# EAGLE board 2x16MUX_1 (EAGLE 6.5.0)
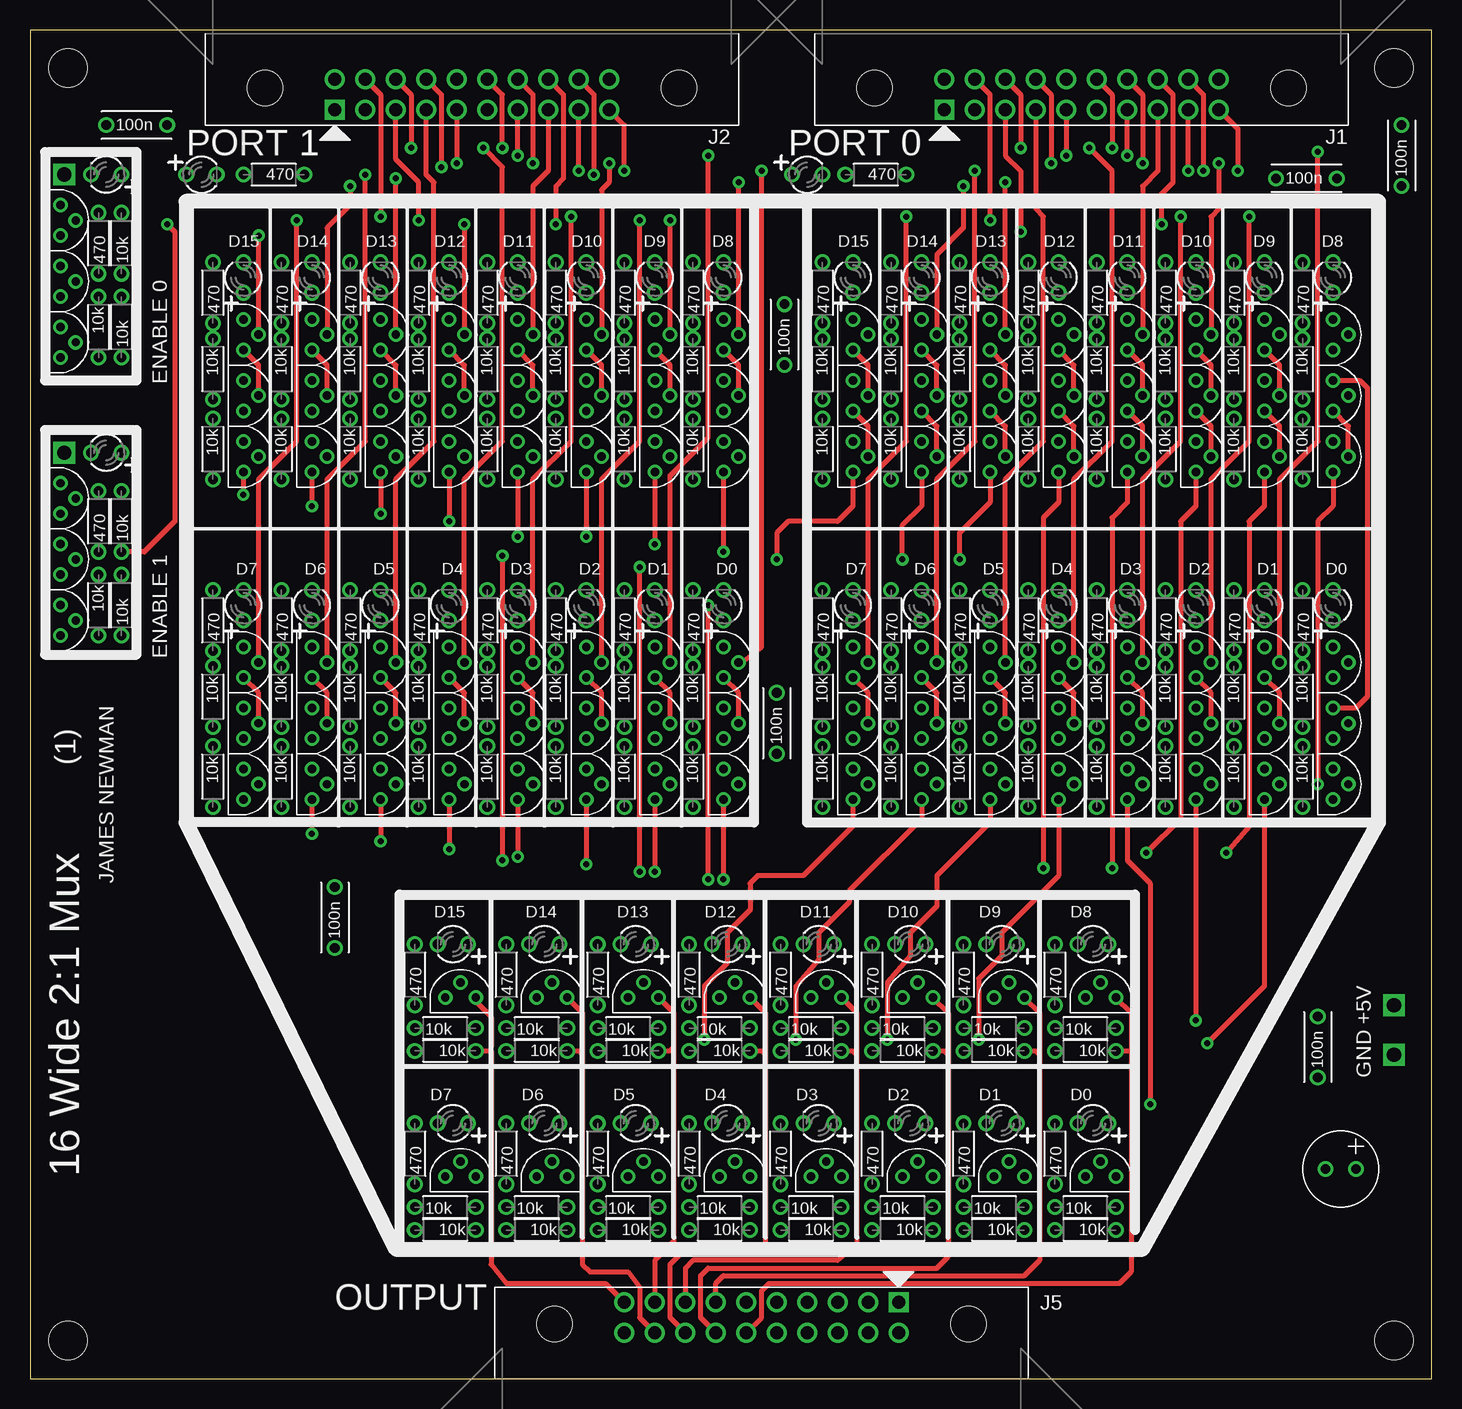
[diagram p10: board, top side]
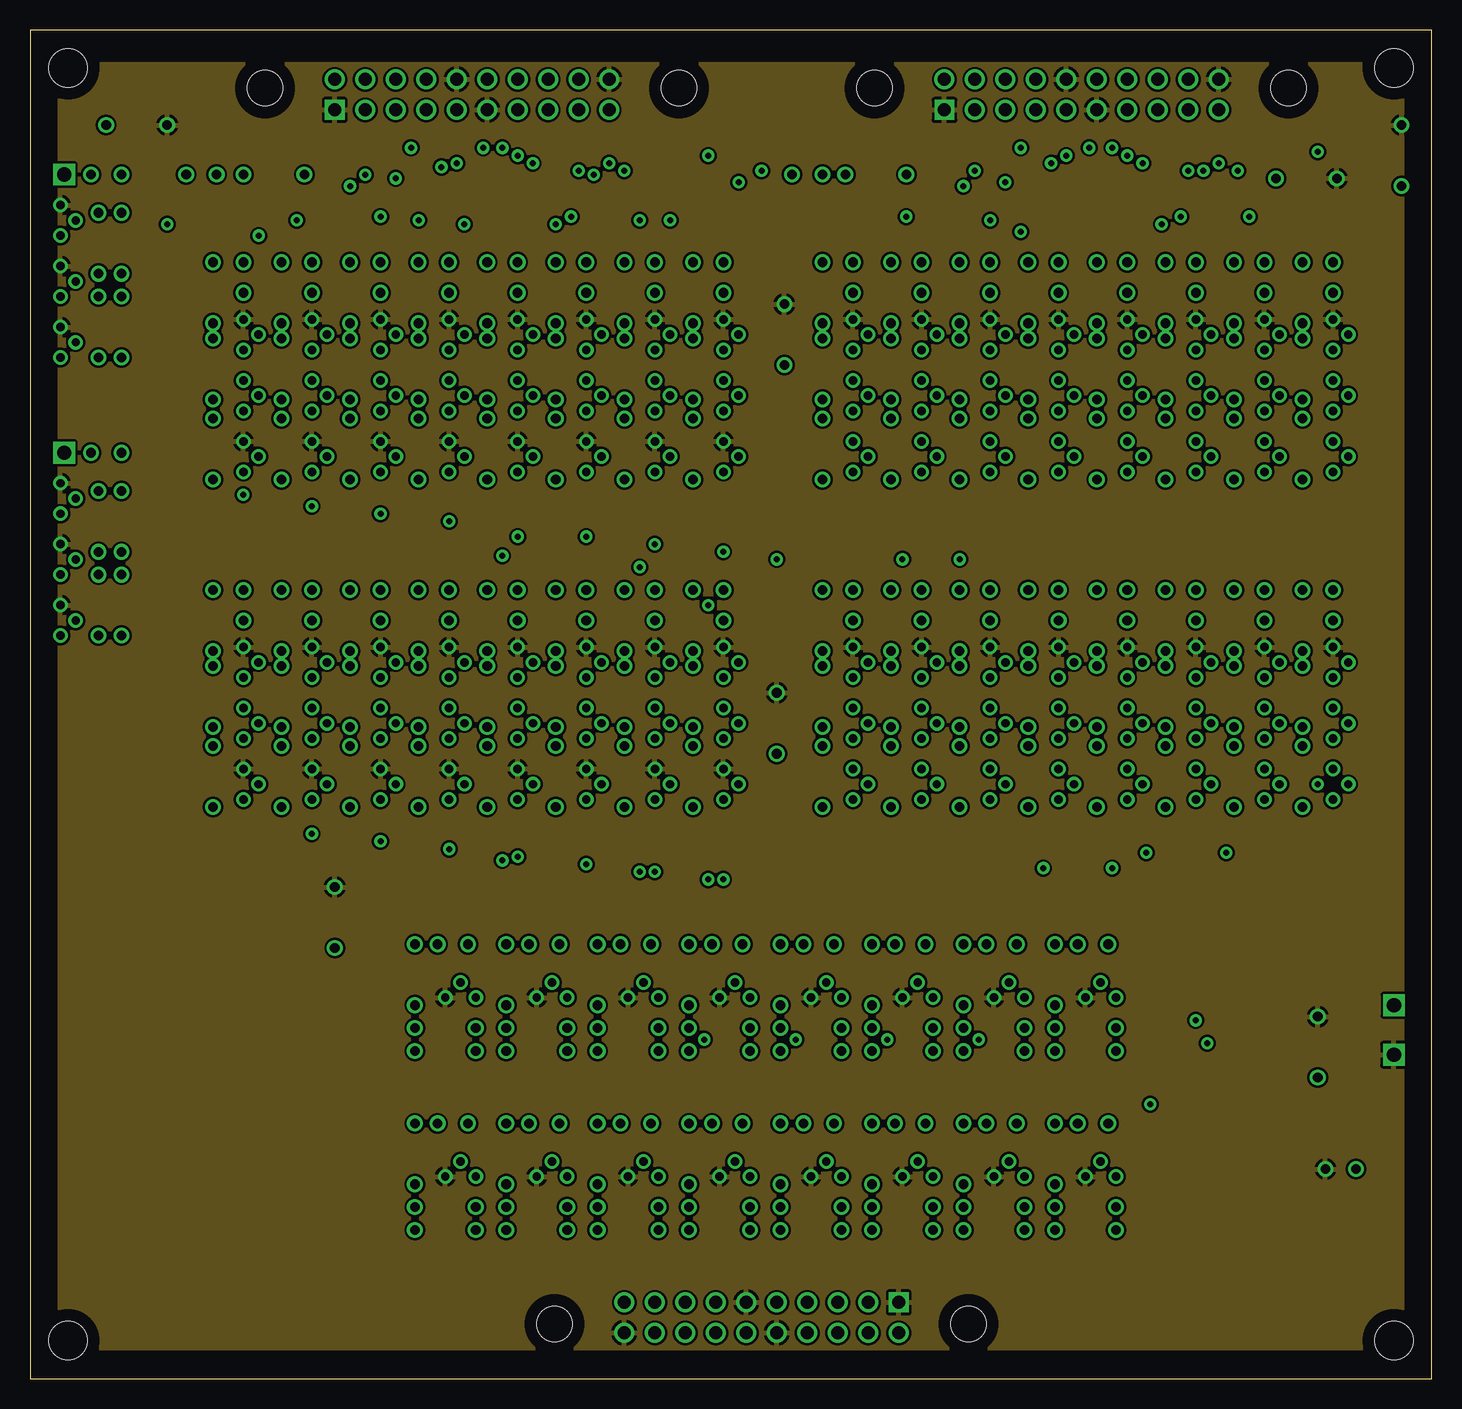
[diagram p11: board, inner layer Route2]
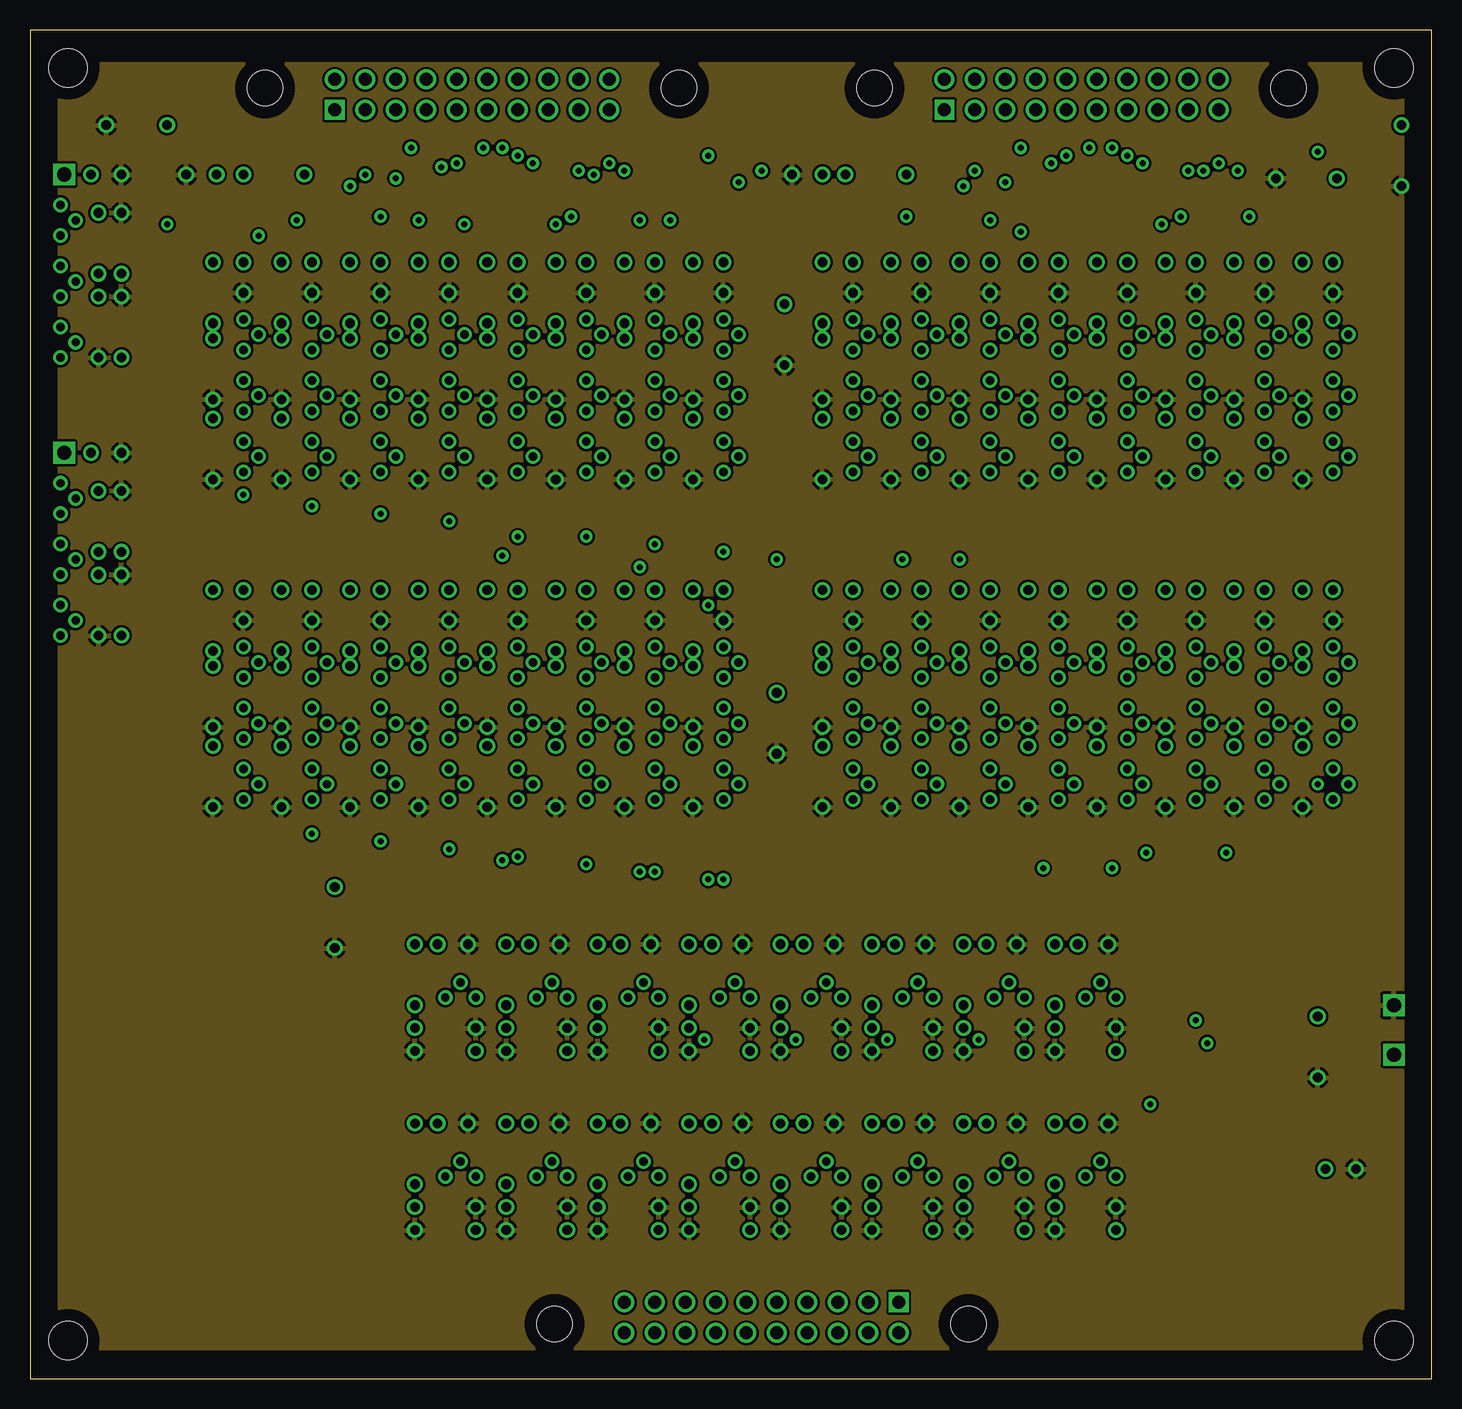
[diagram p12: board, inner layer Route3]
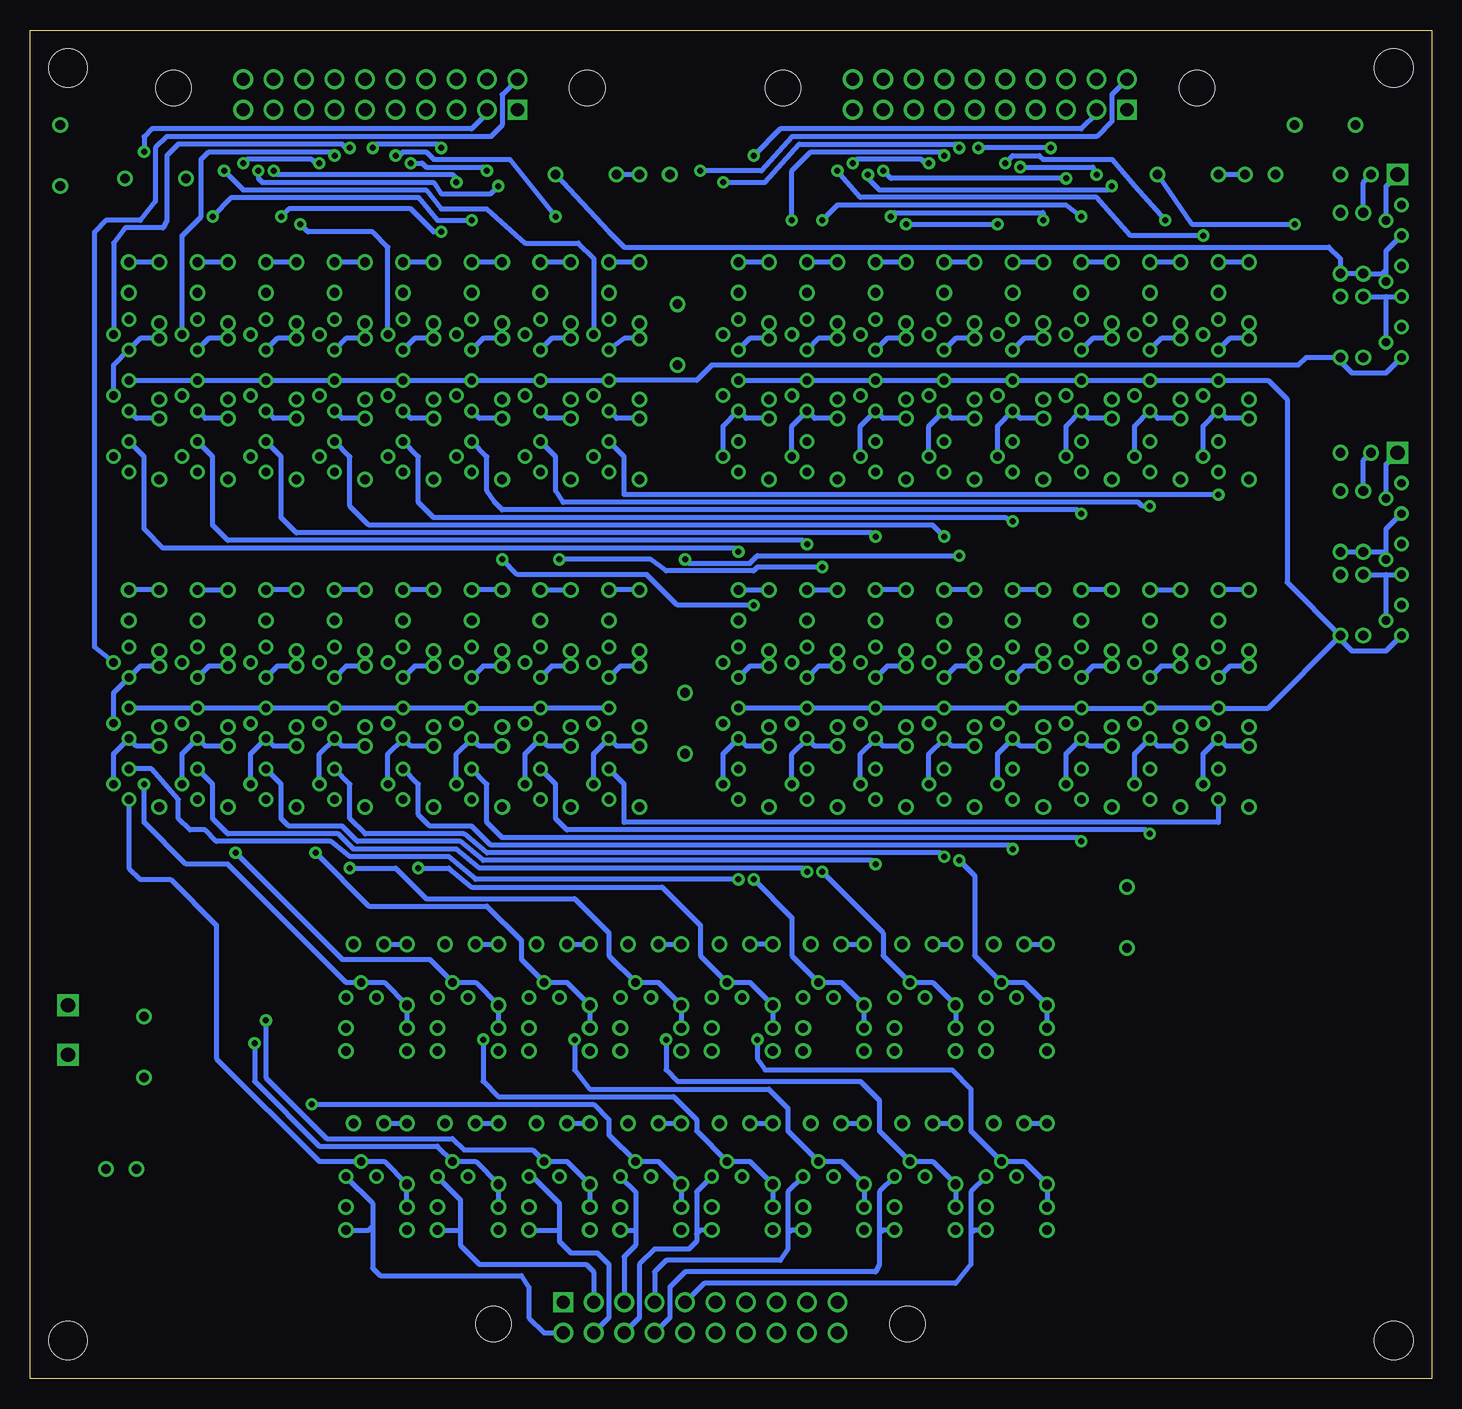
[diagram p13: board, bottom side, seen from below]

Size 116.82 x 112.38 mm. Coordinates in mm from the lower left corner, seen from the top.
Outline: 0,0 116.82,0 116.82,112.38 0,112.38 0,0
Copper layers (1*2+3*16): Top 0.035mm / dielectric 0.2mm / Route2 0.035mm / dielectric 1mm / Route3 0.035mm / dielectric 0.2mm / Bottom 0.035mm
Design rules "processor_rules_4layer": minimum track width 10mil, minimum drill 0.0236mm, track to track 8mil, track to pad 8mil, pad to pad 8mil, via to via 8mil, smd to smd 8mil, copper to edge 40mil, drill to drill 8mil, minimum pad ring 10mil, minimum via ring 8mil, stop-mask expansion 4mil, vias tented up to drill 0.7mm, thermal gap 10mil

## Footprints (pad centres in the part's own frame; a part is rotated, then mirrored left to right if it is on the bottom)
CAP_P2INCH = drill 0.8: 1 -2.54,0; 2 2.54,0
POLARISED_CAP_2P5_6P3MM = drill 0.8: A 1.27,0; K -1.27,0
LED3MM = drill 0.8: A -1.27,0; K 1.27,0
3M_HOLE = hole 3.2: 0,0
20_HDR_LOCKING_RA = drill 1.1 square: 1 -11.43,-1.27 | drill 1.1: 2 -11.43,1.27; 3 -8.89,-1.27; 4 -8.89,1.27; 5 -6.35,-1.27; 6 -6.35,1.27; 7 -3.81,-1.27; 8 -3.81,1.27; 9 -1.27,-1.27; 10 -1.27,1.27; 11 1.27,-1.27; 12 1.27,1.27; 13 3.81,-1.27; 14 3.81,1.27; 15 6.35,-1.27; 16 6.35,1.27; 17 8.89,-1.27; 18 8.89,1.27; 19 11.43,-1.27; 20 11.43,1.27 | hole 2.946: -17.247,0.533; 17.247,0.533
TO92-DGS = drill 0.7: D 0,1.27; G -1.27,0; S 0,-1.27
R_P2INCH = drill 0.8: 1 -2.54,0; 2 2.54,0
TEST_LOOP = drill 1.2 square: P$1 0,0

## Placement (x,y rotation side)
C1  100n  [CAP_P2INCH]  62.23,54.61 90 top
C2  100n  [CAP_P2INCH]  114.3,101.92 90 top
C3  100n  [CAP_P2INCH]  8.89,104.46 0 top
C4  100n  [CAP_P2INCH]  62.87,87 90 top
C5  100n  [CAP_P2INCH]  106.36,100.01 0 top
C6  100n  [CAP_P2INCH]  107.31,27.62 90 top
C7  100u  [POLARISED_CAP_2P5_6P3MM]  109.22,17.46 0 top
C8  100n  [CAP_P2INCH]  25.4,38.42 90 top
D1  L-1334SRT  [LED3MM]  108.58,64.45 90 top
D2  L-1334SRT  [LED3MM]  102.87,64.45 90 top
D3  L-1334SRT  [LED3MM]  97.16,64.45 90 top
D4  L-1334SRT  [LED3MM]  91.44,64.45 90 top
D5  L-1334SRT  [LED3MM]  85.72,64.45 90 top
D6  L-1334SRT  [LED3MM]  80.01,64.45 90 top
D7  L-1334SRT  [LED3MM]  74.3,64.45 90 top
D8  L-1334SRT  [LED3MM]  68.58,64.45 90 top
D9  L-1334SRT  [LED3MM]  108.58,91.76 90 top
D10  L-1334SRT  [LED3MM]  102.87,91.76 90 top
D11  L-1334SRT  [LED3MM]  97.16,91.76 90 top
D12  L-1334SRT  [LED3MM]  91.44,91.76 90 top
D13  L-1334SRT  [LED3MM]  85.72,91.76 90 top
D14  L-1334SRT  [LED3MM]  80.01,91.76 90 top
D15  L-1334SRT  [LED3MM]  74.3,91.76 90 top
D16  L-1334SRT  [LED3MM]  68.58,91.76 90 top
D17  L-1334SRT  [LED3MM]  57.78,64.45 90 top
D18  L-1334SRT  [LED3MM]  52.07,64.45 90 top
D19  L-1334SRT  [LED3MM]  46.35,64.45 90 top
D20  L-1334SRT  [LED3MM]  40.64,64.45 90 top
D21  L-1334SRT  [LED3MM]  34.92,64.45 90 top
D22  L-1334SRT  [LED3MM]  29.21,64.45 90 top
D23  L-1334SRT  [LED3MM]  23.5,64.45 90 top
D24  L-1334SRT  [LED3MM]  17.78,64.45 90 top
D25  L-1334SRT  [LED3MM]  57.78,91.76 90 top
D26  L-1334SRT  [LED3MM]  52.07,91.76 90 top
D27  L-1334SRT  [LED3MM]  46.35,91.76 90 top
D28  L-1334SRT  [LED3MM]  40.64,91.76 90 top
D29  L-1334SRT  [LED3MM]  34.92,91.76 90 top
D30  L-1334SRT  [LED3MM]  29.21,91.76 90 top
D31  L-1334SRT  [LED3MM]  23.5,91.76 90 top
D32  L-1334SRT  [LED3MM]  17.78,91.76 90 top
D65  L-1334SRT  [LED3MM]  6.35,100.33 180 top
D66  L-1334SRT  [LED3MM]  6.35,77.15 180 top
D69  L-1334SRT  [LED3MM]  88.58,21.27 180 top
D70  L-1334SRT  [LED3MM]  80.96,21.27 180 top
D71  L-1334SRT  [LED3MM]  73.34,21.27 180 top
D72  L-1334SRT  [LED3MM]  65.72,21.27 180 top
D73  L-1334SRT  [LED3MM]  58.1,21.27 180 top
D74  L-1334SRT  [LED3MM]  50.48,21.27 180 top
D75  L-1334SRT  [LED3MM]  42.86,21.27 180 top
D76  L-1334SRT  [LED3MM]  35.24,21.27 180 top
D77  L-1334SRT  [LED3MM]  88.58,36.2 180 top
D78  L-1334SRT  [LED3MM]  80.96,36.2 180 top
D79  L-1334SRT  [LED3MM]  73.34,36.2 180 top
D80  L-1334SRT  [LED3MM]  65.72,36.2 180 top
D81  L-1334SRT  [LED3MM]  58.1,36.2 180 top
D82  L-1334SRT  [LED3MM]  50.48,36.2 180 top
D83  L-1334SRT  [LED3MM]  42.86,36.2 180 top
D84  L-1334SRT  [LED3MM]  35.24,36.2 180 top
D85  L-1334SRT  [LED3MM]  64.77,100.33 0 top
D86  L-1334SRT  [LED3MM]  14.29,100.33 0 top
H1  3M_MOUNT_HOLE  [3M_HOLE]  3.17,109.22 0 top
H2  3M_MOUNT_HOLE  [3M_HOLE]  3.17,3.17 0 top
H3  3M_MOUNT_HOLE  [3M_HOLE]  113.67,3.17 0 top
H4  3M_MOUNT_HOLE  [3M_HOLE]  113.67,109.22 0 top
J1  20_HDR_LOCKING_RA  [20_HDR_LOCKING_RA]  87.63,107 0 top
J2  20_HDR_LOCKING_RA  [20_HDR_LOCKING_RA]  36.83,107 0 top
J5  20_HDR_LOCKING_RA  [20_HDR_LOCKING_RA]  60.96,5.08 180 top
Q1  2N7000  [TO92-DGS]  108.58,59.69 180 top
Q2  2N7000  [TO92-DGS]  108.58,54.61 180 top
Q3  2N7000  [TO92-DGS]  102.87,59.69 180 top
Q4  2N7000  [TO92-DGS]  102.87,54.61 180 top
Q5  2N7000  [TO92-DGS]  97.16,59.69 180 top
Q6  2N7000  [TO92-DGS]  97.16,54.61 180 top
Q7  2N7000  [TO92-DGS]  91.44,59.69 180 top
Q8  2N7000  [TO92-DGS]  91.44,54.61 180 top
Q9  2N7000  [TO92-DGS]  85.72,59.69 180 top
Q10  2N7000  [TO92-DGS]  85.72,54.61 180 top
Q11  2N7000  [TO92-DGS]  80.01,59.69 180 top
Q12  2N7000  [TO92-DGS]  80.01,54.61 180 top
Q13  2N7000  [TO92-DGS]  74.3,59.69 180 top
Q14  2N7000  [TO92-DGS]  74.3,54.61 180 top
Q15  2N7000  [TO92-DGS]  68.58,59.69 180 top
Q16  2N7000  [TO92-DGS]  68.58,54.61 180 top
Q17  2N7000  [TO92-DGS]  108.58,87 180 top
Q18  2N7000  [TO92-DGS]  108.58,81.92 180 top
Q19  2N7000  [TO92-DGS]  102.87,87 180 top
Q20  2N7000  [TO92-DGS]  102.87,81.92 180 top
Q21  2N7000  [TO92-DGS]  97.16,87 180 top
Q22  2N7000  [TO92-DGS]  97.16,81.92 180 top
Q23  2N7000  [TO92-DGS]  91.44,87 180 top
Q24  2N7000  [TO92-DGS]  91.44,81.92 180 top
Q25  2N7000  [TO92-DGS]  85.72,87 180 top
Q26  2N7000  [TO92-DGS]  85.72,81.92 180 top
Q27  2N7000  [TO92-DGS]  80.01,87 180 top
Q28  2N7000  [TO92-DGS]  80.01,81.92 180 top
Q29  2N7000  [TO92-DGS]  74.3,87 180 top
Q30  2N7000  [TO92-DGS]  74.3,81.92 180 top
Q31  2N7000  [TO92-DGS]  68.58,87 180 top
Q32  2N7000  [TO92-DGS]  68.58,81.92 180 top
Q33  2N7000  [TO92-DGS]  57.78,59.69 180 top
Q34  2N7000  [TO92-DGS]  57.78,54.61 180 top
Q35  2N7000  [TO92-DGS]  52.07,59.69 180 top
Q36  2N7000  [TO92-DGS]  52.07,54.61 180 top
Q37  2N7000  [TO92-DGS]  46.35,59.69 180 top
Q38  2N7000  [TO92-DGS]  46.35,54.61 180 top
Q39  2N7000  [TO92-DGS]  40.64,59.69 180 top
Q40  2N7000  [TO92-DGS]  40.64,54.61 180 top
Q41  2N7000  [TO92-DGS]  34.92,59.69 180 top
Q42  2N7000  [TO92-DGS]  34.92,54.61 180 top
Q43  2N7000  [TO92-DGS]  29.21,59.69 180 top
Q44  2N7000  [TO92-DGS]  29.21,54.61 180 top
Q45  2N7000  [TO92-DGS]  23.5,59.69 180 top
Q46  2N7000  [TO92-DGS]  23.5,54.61 180 top
Q47  2N7000  [TO92-DGS]  17.78,59.69 180 top
Q48  2N7000  [TO92-DGS]  17.78,54.61 180 top
Q49  2N7000  [TO92-DGS]  57.78,87 180 top
Q50  2N7000  [TO92-DGS]  57.78,81.92 180 top
Q51  2N7000  [TO92-DGS]  52.07,87 180 top
Q52  2N7000  [TO92-DGS]  52.07,81.92 180 top
Q53  2N7000  [TO92-DGS]  46.35,87 180 top
Q54  2N7000  [TO92-DGS]  46.35,81.92 180 top
Q55  2N7000  [TO92-DGS]  40.64,87 180 top
Q56  2N7000  [TO92-DGS]  40.64,81.92 180 top
Q57  2N7000  [TO92-DGS]  34.92,87 180 top
Q58  2N7000  [TO92-DGS]  34.92,81.92 180 top
Q59  2N7000  [TO92-DGS]  29.21,87 180 top
Q60  2N7000  [TO92-DGS]  29.21,81.92 180 top
Q61  2N7000  [TO92-DGS]  23.5,87 180 top
Q62  2N7000  [TO92-DGS]  23.5,81.92 180 top
Q63  2N7000  [TO92-DGS]  17.78,87 180 top
Q64  2N7000  [TO92-DGS]  17.78,81.92 180 top
Q129  2N7000  [TO92-DGS]  2.54,96.52 180 top
Q130  2N7000  [TO92-DGS]  2.54,91.44 180 top
Q131  2N7000  [TO92-DGS]  2.54,86.36 180 top
Q132  2N7000  [TO92-DGS]  2.54,73.34 180 top
Q133  2N7000  [TO92-DGS]  2.54,68.26 180 top
Q134  2N7000  [TO92-DGS]  2.54,63.18 180 top
Q141  2N7000  [TO92-DGS]  108.58,49.53 180 top
Q142  2N7000  [TO92-DGS]  89.22,16.83 270 top
Q143  2N7000  [TO92-DGS]  57.78,49.53 180 top
Q146  2N7000  [TO92-DGS]  102.87,49.53 180 top
Q147  2N7000  [TO92-DGS]  81.6,16.83 270 top
Q148  2N7000  [TO92-DGS]  52.07,49.53 180 top
Q151  2N7000  [TO92-DGS]  97.16,49.53 180 top
Q152  2N7000  [TO92-DGS]  73.98,16.83 270 top
Q153  2N7000  [TO92-DGS]  46.35,49.53 180 top
Q156  2N7000  [TO92-DGS]  91.44,49.53 180 top
Q157  2N7000  [TO92-DGS]  66.36,16.83 270 top
Q158  2N7000  [TO92-DGS]  40.64,49.53 180 top
Q161  2N7000  [TO92-DGS]  85.72,49.53 180 top
Q162  2N7000  [TO92-DGS]  58.74,16.83 270 top
Q163  2N7000  [TO92-DGS]  34.92,49.53 180 top
Q166  2N7000  [TO92-DGS]  80.01,49.53 180 top
Q167  2N7000  [TO92-DGS]  51.12,16.83 270 top
Q168  2N7000  [TO92-DGS]  29.21,49.53 180 top
Q171  2N7000  [TO92-DGS]  74.3,49.53 180 top
Q172  2N7000  [TO92-DGS]  43.5,16.83 270 top
Q173  2N7000  [TO92-DGS]  23.5,49.53 180 top
Q176  2N7000  [TO92-DGS]  68.58,49.53 180 top
Q177  2N7000  [TO92-DGS]  35.88,16.83 270 top
Q178  2N7000  [TO92-DGS]  17.78,49.53 180 top
Q181  2N7000  [TO92-DGS]  108.58,76.83 180 top
Q182  2N7000  [TO92-DGS]  89.22,31.75 270 top
Q183  2N7000  [TO92-DGS]  57.78,76.83 180 top
Q186  2N7000  [TO92-DGS]  102.87,76.83 180 top
Q187  2N7000  [TO92-DGS]  81.6,31.75 270 top
Q188  2N7000  [TO92-DGS]  52.07,76.83 180 top
Q191  2N7000  [TO92-DGS]  97.16,76.83 180 top
Q192  2N7000  [TO92-DGS]  73.98,31.75 270 top
Q193  2N7000  [TO92-DGS]  46.35,76.83 180 top
Q196  2N7000  [TO92-DGS]  91.44,76.83 180 top
Q197  2N7000  [TO92-DGS]  66.36,31.75 270 top
Q198  2N7000  [TO92-DGS]  40.64,76.83 180 top
Q201  2N7000  [TO92-DGS]  85.72,76.83 180 top
Q202  2N7000  [TO92-DGS]  58.74,31.75 270 top
Q203  2N7000  [TO92-DGS]  34.92,76.83 180 top
Q206  2N7000  [TO92-DGS]  80.01,76.83 180 top
Q207  2N7000  [TO92-DGS]  51.12,31.75 270 top
Q208  2N7000  [TO92-DGS]  29.21,76.83 180 top
Q211  2N7000  [TO92-DGS]  74.3,76.83 180 top
Q212  2N7000  [TO92-DGS]  43.5,31.75 270 top
Q213  2N7000  [TO92-DGS]  23.5,76.83 180 top
Q216  2N7000  [TO92-DGS]  68.58,76.83 180 top
Q217  2N7000  [TO92-DGS]  35.88,31.75 270 top
Q218  2N7000  [TO92-DGS]  17.78,76.83 180 top
R1  10k  [R_P2INCH]  106.05,56.83 270 top
R2  470  [R_P2INCH]  106.05,63.18 90 top
R3  10k  [R_P2INCH]  100.33,56.83 270 top
R4  470  [R_P2INCH]  100.33,63.18 90 top
R5  10k  [R_P2INCH]  94.61,56.83 270 top
R6  470  [R_P2INCH]  94.61,63.18 90 top
R7  10k  [R_P2INCH]  88.9,56.83 270 top
R8  470  [R_P2INCH]  88.9,63.18 90 top
R9  10k  [R_P2INCH]  83.19,56.83 270 top
R10  470  [R_P2INCH]  83.19,63.18 90 top
R11  10k  [R_P2INCH]  77.47,56.83 270 top
R12  470  [R_P2INCH]  77.47,63.18 90 top
R13  10k  [R_P2INCH]  71.75,56.83 270 top
R14  470  [R_P2INCH]  71.75,63.18 90 top
R15  10k  [R_P2INCH]  66.04,56.83 270 top
R16  470  [R_P2INCH]  66.04,63.18 90 top
R17  10k  [R_P2INCH]  106.05,84.14 270 top
R18  470  [R_P2INCH]  106.05,90.49 90 top
R19  10k  [R_P2INCH]  100.33,84.14 270 top
R20  470  [R_P2INCH]  100.33,90.49 90 top
R21  10k  [R_P2INCH]  94.61,84.14 270 top
R22  470  [R_P2INCH]  94.61,90.49 90 top
R23  10k  [R_P2INCH]  88.9,84.14 270 top
R24  470  [R_P2INCH]  88.9,90.49 90 top
R25  10k  [R_P2INCH]  83.19,84.14 270 top
R26  470  [R_P2INCH]  83.19,90.49 90 top
R27  10k  [R_P2INCH]  77.47,84.14 270 top
R28  470  [R_P2INCH]  77.47,90.49 90 top
R29  10k  [R_P2INCH]  71.75,84.14 270 top
R30  470  [R_P2INCH]  71.75,90.49 90 top
R31  10k  [R_P2INCH]  66.04,84.14 270 top
R32  470  [R_P2INCH]  66.04,90.49 90 top
R33  10k  [R_P2INCH]  55.24,56.83 270 top
R34  470  [R_P2INCH]  55.24,63.18 90 top
R35  10k  [R_P2INCH]  49.53,56.83 270 top
R36  470  [R_P2INCH]  49.53,63.18 90 top
R37  10k  [R_P2INCH]  43.81,56.83 270 top
R38  470  [R_P2INCH]  43.81,63.18 90 top
R39  10k  [R_P2INCH]  38.1,56.83 270 top
R40  470  [R_P2INCH]  38.1,63.18 90 top
R41  10k  [R_P2INCH]  32.38,56.83 270 top
R42  470  [R_P2INCH]  32.38,63.18 90 top
R43  10k  [R_P2INCH]  26.67,56.83 270 top
R44  470  [R_P2INCH]  26.67,63.18 90 top
R45  10k  [R_P2INCH]  20.95,56.83 270 top
R46  470  [R_P2INCH]  20.95,63.18 90 top
R47  10k  [R_P2INCH]  15.24,56.83 270 top
R48  470  [R_P2INCH]  15.24,63.18 90 top
R49  10k  [R_P2INCH]  55.24,84.14 270 top
R50  470  [R_P2INCH]  55.24,90.49 90 top
R51  10k  [R_P2INCH]  49.53,84.14 270 top
R52  470  [R_P2INCH]  49.53,90.49 90 top
R53  10k  [R_P2INCH]  43.81,84.14 270 top
R54  470  [R_P2INCH]  43.81,90.49 90 top
R55  10k  [R_P2INCH]  38.1,84.14 270 top
R56  470  [R_P2INCH]  38.1,90.49 90 top
R57  10k  [R_P2INCH]  32.38,84.14 270 top
R58  470  [R_P2INCH]  32.38,90.49 90 top
R59  10k  [R_P2INCH]  26.67,84.14 270 top
R60  470  [R_P2INCH]  26.67,90.49 90 top
R61  10k  [R_P2INCH]  20.95,84.14 270 top
R62  470  [R_P2INCH]  20.95,90.49 90 top
R63  10k  [R_P2INCH]  15.24,84.14 270 top
R64  470  [R_P2INCH]  15.24,90.49 90 top
R65  10k  [R_P2INCH]  87.95,12.38 180 top
R66  10k  [R_P2INCH]  80.33,12.38 180 top
R67  10k  [R_P2INCH]  72.71,12.38 180 top
R68  10k  [R_P2INCH]  65.09,12.38 180 top
R69  10k  [R_P2INCH]  57.47,12.38 180 top
R70  10k  [R_P2INCH]  49.85,12.38 180 top
R71  10k  [R_P2INCH]  42.23,12.38 180 top
R72  10k  [R_P2INCH]  34.61,12.38 180 top
R73  10k  [R_P2INCH]  87.95,27.3 180 top
R74  10k  [R_P2INCH]  80.33,27.3 180 top
R75  10k  [R_P2INCH]  72.71,27.3 180 top
R76  10k  [R_P2INCH]  65.09,27.3 180 top
R77  10k  [R_P2INCH]  57.47,27.3 180 top
R78  10k  [R_P2INCH]  49.85,27.3 180 top
R79  10k  [R_P2INCH]  42.23,27.3 180 top
R80  10k  [R_P2INCH]  34.61,27.3 180 top
R129  10k  [R_P2INCH]  7.62,94.61 90 top
R130  470  [R_P2INCH]  5.71,94.61 90 top
R131  10k  [R_P2INCH]  5.71,87.63 270 top
R132  10k  [R_P2INCH]  7.62,87.63 90 top
R133  10k  [R_P2INCH]  7.62,71.44 90 top
R134  470  [R_P2INCH]  5.71,71.44 90 top
R135  10k  [R_P2INCH]  5.71,64.45 270 top
R136  10k  [R_P2INCH]  7.62,64.45 90 top
R145  10k  [R_P2INCH]  87.95,14.29 0 top
R146  470  [R_P2INCH]  85.41,18.73 90 top
R147  10k  [R_P2INCH]  80.33,14.29 0 top
R148  470  [R_P2INCH]  77.79,18.73 90 top
R149  10k  [R_P2INCH]  72.71,14.29 0 top
R150  470  [R_P2INCH]  70.17,18.73 90 top
R151  10k  [R_P2INCH]  65.09,14.29 0 top
R152  470  [R_P2INCH]  62.55,18.73 90 top
R153  10k  [R_P2INCH]  57.47,14.29 0 top
R154  470  [R_P2INCH]  54.93,18.73 90 top
R155  10k  [R_P2INCH]  49.85,14.29 0 top
R156  470  [R_P2INCH]  47.31,18.73 90 top
R157  10k  [R_P2INCH]  42.23,14.29 0 top
R158  470  [R_P2INCH]  39.69,18.73 90 top
R159  10k  [R_P2INCH]  34.61,14.29 0 top
R160  470  [R_P2INCH]  32.07,18.73 90 top
R161  10k  [R_P2INCH]  87.95,29.21 0 top
R162  470  [R_P2INCH]  85.41,33.66 90 top
R163  10k  [R_P2INCH]  80.33,29.21 0 top
R164  470  [R_P2INCH]  77.79,33.66 90 top
R165  10k  [R_P2INCH]  72.71,29.21 0 top
R166  470  [R_P2INCH]  70.17,33.66 90 top
R167  10k  [R_P2INCH]  65.09,29.21 0 top
R168  470  [R_P2INCH]  62.55,33.66 90 top
R169  10k  [R_P2INCH]  57.47,29.21 0 top
R170  470  [R_P2INCH]  54.93,33.66 90 top
R171  10k  [R_P2INCH]  49.85,29.21 0 top
R172  470  [R_P2INCH]  47.31,33.66 90 top
R173  10k  [R_P2INCH]  42.23,29.21 0 top
R174  470  [R_P2INCH]  39.69,33.66 90 top
R175  10k  [R_P2INCH]  34.61,29.21 0 top
R176  470  [R_P2INCH]  32.07,33.66 90 top
R177  470  [R_P2INCH]  70.48,100.33 180 top
R178  470  [R_P2INCH]  20.32,100.33 180 top
R181  10k  [R_P2INCH]  106.05,50.16 270 top
R182  10k  [R_P2INCH]  100.33,50.16 270 top
R183  10k  [R_P2INCH]  94.61,50.16 270 top
R184  10k  [R_P2INCH]  88.9,50.16 270 top
R185  10k  [R_P2INCH]  83.19,50.16 270 top
R186  10k  [R_P2INCH]  77.47,50.16 270 top
R187  10k  [R_P2INCH]  71.75,50.16 270 top
R188  10k  [R_P2INCH]  66.04,50.16 270 top
R189  10k  [R_P2INCH]  106.05,77.47 270 top
R190  10k  [R_P2INCH]  100.33,77.47 270 top
R191  10k  [R_P2INCH]  94.61,77.47 270 top
R192  10k  [R_P2INCH]  88.9,77.47 270 top
R193  10k  [R_P2INCH]  83.19,77.47 270 top
R194  10k  [R_P2INCH]  77.47,77.47 270 top
R195  10k  [R_P2INCH]  71.75,77.47 270 top
R196  10k  [R_P2INCH]  66.04,77.47 270 top
R197  10k  [R_P2INCH]  55.24,50.16 270 top
R198  10k  [R_P2INCH]  49.53,50.16 270 top
R199  10k  [R_P2INCH]  43.81,50.16 270 top
R200  10k  [R_P2INCH]  38.1,50.16 270 top
R201  10k  [R_P2INCH]  32.38,50.16 270 top
R202  10k  [R_P2INCH]  26.67,50.16 270 top
R203  10k  [R_P2INCH]  20.95,50.16 270 top
R204  10k  [R_P2INCH]  15.24,50.16 270 top
R205  10k  [R_P2INCH]  55.24,77.47 270 top
R206  10k  [R_P2INCH]  49.53,77.47 270 top
R207  10k  [R_P2INCH]  43.81,77.47 270 top
R208  10k  [R_P2INCH]  38.1,77.47 270 top
R209  10k  [R_P2INCH]  32.38,77.47 270 top
R210  10k  [R_P2INCH]  26.67,77.47 270 top
R211  10k  [R_P2INCH]  20.95,77.47 270 top
R212  10k  [R_P2INCH]  15.24,77.47 270 top
TP1  [TEST_LOOP]  2.86,100.33 90 top
TP2  [TEST_LOOP]  2.86,77.15 90 top
TP5  [TEST_LOOP]  113.67,31.11 0 top
TP6  [TEST_LOOP]  113.67,26.99 0 top

## Tracks (layer width: path | path; a pad name or v marks a point on that pad's centre or on a via)
+5V
  pour Route3: 2.54,2.54 2.54,109.54 114.3,109.54 114.3,2.54
DOUT0
  Bottom 0.406: Q142.D 88.27,14.61 88.27,12.7 | 88.27,12.7 88.27,9.21 87.63,8.57 75.88,8.57 75.25,7.62 75.25,5.08 73.98,3.81 J5.2 | R65.1 88.58,12.38 88.27,12.7
DOUT1
  Bottom 0.406: Q147.D 80.96,14.92 80.96,12.38 | 80.96,12.38 80.96,11.11 79.38,9.53 70.48,9.53 69.85,8.89 J5.3 | R66.1 80.96,12.38
DOUT2
  Bottom 0.406: Q152.D 74.93,16.83 72.71,14.61 72.71,12.38 | 72.71,12.38 72.71,11.43 71.75,10.48 69.53,10.48 68.58,9.53 68.58,5.08 J5.4 | R67.1 72.71,12.38
DOUT3
  Bottom 0.406: Q157.D 66.36,15.56 66.36,12.38 | 66.36,12.38 66.36,11.11 67.31,10.16 J5.5 | R68.1 66.36,12.38
DOUT4
  Bottom 0.406: Q162.D 61.28,15.56 61.28,12.06 | 61.28,12.06 61.28,11.43 61.91,10.79 64.77,10.79 66.04,9.53 66.04,5.08 J5.6 | R69.1 60.96,12.38 61.28,12.06
DOUT5
  Bottom 0.406: Q167.D 53.66,15.56 53.66,12.06 | 53.66,12.06 53.66,10.79 54.29,9.84 63.82,9.84 64.77,8.89 J5.7 | R70.1 53.34,12.38 53.66,12.06
DOUT6
  Bottom 0.406: Q172.D 46.04,15.56 46.04,12.06 | 46.04,12.06 46.04,9.53 46.35,8.89 62.23,8.89 63.5,7.62 63.5,5.08 J5.8 | R71.1 45.72,12.38 46.04,12.06
DOUT7
  Bottom 0.406: Q177.D 38.42,15.56 38.42,12.06 | 38.42,12.06 38.42,9.53 39.69,7.94 60.64,7.94 J5.9 | R72.1 38.1,12.38 38.42,12.06
DOUT8
  Top 0.406: Q182.D 91.76,30.48 91.76,27.3 | 91.76,27.3 91.76,8.89 90.81,7.94 61.59,7.94 60.96,7.3 60.96,5.08 J5.12 | R73.1 91.76,27.3
DOUT9
  Top 0.406: Q187.D 84.14,30.48 84.14,26.99 | 84.14,26.99 84.14,9.84 82.87,8.57 57.78,8.57 57.15,7.94 J5.13 | R74.1 83.82,27.3 84.14,26.99
DOUT10
  Top 0.406: Q192.D 76.52,30.48 76.52,26.99 | 76.52,26.99 76.52,10.16 75.56,9.21 56.52,9.21 55.88,8.57 55.88,5.08 J5.14 | R75.1 76.2,27.3 76.52,26.99
DOUT11
  Top 0.406: Q197.D 68.9,30.48 68.9,26.99 | 68.9,26.99 68.9,11.11 67.31,9.84 55.24,9.84 54.61,9.21 J5.15 | R76.1 68.58,27.3 68.9,26.99
DOUT12
  Top 0.406: Q202.D 61.28,30.48 61.28,26.99 | 61.28,26.99 61.28,11.11 60.64,10.48 54.29,10.48 53.34,9.53 53.34,5.08 J5.16 | R77.1 60.96,27.3 61.28,26.99
DOUT13
  Top 0.406: Q207.D 53.66,30.48 53.66,27.62 | 53.66,27.62 53.66,11.43 52.07,9.84 J5.17 | R78.1 53.34,27.3 53.66,27.62
DOUT14
  Top 0.406: Q212.D 46.04,30.48 46.04,26.99 | 46.04,26.99 46.04,9.53 46.67,8.89 49.85,8.89 50.8,7.62 50.8,5.08 J5.18 | R79.1 45.72,27.3 46.04,26.99
DOUT15
  Top 0.406: Q217.D 37.15,31.43 38.42,30.16 38.42,27.62 38.42,27.3 | 38.42,27.3 38.42,9.53 39.69,7.94 47.94,7.94 J5.19 | R80.1 38.42,27.3
E0
  Top 0.406: Q18.S 110.81,83.19 111.44,82.55 111.44,56.83 110.49,55.88 Q2.S
  Bottom 0.406: Q18.S Q20.S Q22.S Q24.S Q26.S Q28.S Q30.S Q32.S 61.28,83.19 60.01,84.45 11.11,84.45 10.48,85.09 R132.1 7.62,84.77 6.67,83.82 3.81,83.82 Q131.D | Q16.S Q14.S Q12.S Q10.S Q8.S Q6.S Q4.S Q2.S
E1
  Bottom 0.406: Q50.S Q52.S Q54.S Q56.S Q58.S Q60.S Q62.S Q64.S 13.65,83.19 12.06,81.6 12.06,66.36 R136.1 | Q34.S Q36.S Q38.S Q40.S Q42.S Q44.S Q46.S Q48.S 13.65,55.88 R136.1 | R136.1 7.62,61.59 6.67,60.64 3.81,60.64 Q134.D
EN0_N
  Bottom 0.406: Q130.G 3.81,92.39 | 3.81,92.39 3.81,93.98 Q129.D | 3.81,92.39 4.13,92.08 R130.1 R129.1 7.62,93.34 8.57,94.3 67.31,94.3 68.58,95.57 R177.1
EN1_N  (via drill 0.5 pad 1.02)
  Top 0.406: v11.43,96.2 12.06,95.57 12.06,71.44 9.53,68.9 R133.1
  Bottom 0.406: R133.1 R134.1 3.81,68.9 | Q133.G 3.81,68.9 | 3.81,68.9 3.81,70.8 Q132.D | R178.1 20,96.2 v11.43,96.2
EN_0
  Bottom 0.406: R131.1 3.81,90.17 | 3.81,90.17 Q130.D | Q131.G 3.81,90.17
EN_1
  Bottom 0.406: Q134.G 3.81,66.99 | 3.81,66.99 Q133.D | R135.1 3.81,66.99
GND
  pour Route2: 2.54,2.54 2.54,109.54 114.3,109.54 114.3,2.54
N$1
  Top 0.406: Q4.G 104.14,57.15 Q3.D
  Bottom 0.406: R4.1 R3.1 101.92,59.37 Q3.D
N$2
  Bottom 0.406: R2.1 R1.1 107.63,59.37 Q1.D 109.86,57.15 Q2.G
N$3
  Bottom 0.406: R2.2 D1.K
N$4
  Bottom 0.406: D2.K R4.2
N$5
  Top 0.406: Q6.G 98.42,57.15 Q5.D
  Bottom 0.406: R6.1 R5.1 96.2,59.37 Q5.D
N$6
  Bottom 0.406: R6.2 D3.K
N$7
  Top 0.406: Q8.G 92.71,57.15 Q7.D
  Bottom 0.406: R8.1 R7.1 90.49,59.37 Q7.D
N$8
  Bottom 0.406: R8.2 D4.K
N$9
  Top 0.406: Q10.G 87,57.15 Q9.D
  Bottom 0.406: R10.1 R9.1 84.77,59.37 Q9.D
N$10
  Bottom 0.406: R10.2 D5.K
N$11
  Top 0.406: Q34.G 59.05,57.15 Q33.D
  Bottom 0.406: Q33.D 56.83,59.37 R33.1 R34.1
N$12
  Top 0.406: Q12.G 81.28,57.15 Q11.D
  Bottom 0.406: R12.1 R11.1 79.06,59.37 Q11.D
N$13
  Bottom 0.406: R12.2 D6.K
N$14
  Top 0.406: Q14.G 75.56,57.15 Q13.D
  Bottom 0.406: R14.1 R13.1 73.34,59.37 Q13.D
N$15
  Bottom 0.406: D7.K R14.2
N$16
  Top 0.406: Q16.G 69.85,57.15 Q15.D
  Bottom 0.406: R16.1 R15.1 67.63,59.37 Q15.D
N$17
  Bottom 0.406: R16.2 D8.K
N$18
  Bottom 0.406: Q18.G 109.86,84.45 Q17.D 107.63,86.68 R17.1 R18.1
N$19
  Bottom 0.406: R18.2 D9.K
N$20
  Top 0.406: Q20.G 104.14,84.45 Q19.D
  Bottom 0.406: Q19.D 101.92,86.68 R19.1 R20.1
N$21
  Bottom 0.406: R20.2 D10.K
N$22
  Bottom 0.406: D17.K R34.2
N$23
  Top 0.406: Q22.G 98.42,84.45 Q21.D
  Bottom 0.406: Q21.D 96.2,86.68 R21.1 R22.1
N$24
  Bottom 0.406: R22.2 D11.K
N$25
  Top 0.406: Q24.G 92.71,84.45 Q23.D
  Bottom 0.406: Q23.D 90.49,86.68 R23.1 R24.1
N$26
  Bottom 0.406: R24.2 D12.K
N$27
  Top 0.406: Q26.G 87,84.45 Q25.D
  Bottom 0.406: Q25.D 84.77,86.68 R25.1 R26.1
N$28
  Bottom 0.406: R26.2 D13.K
N$29
  Top 0.406: Q28.G 81.28,84.45 Q27.D
  Bottom 0.406: Q27.D 79.06,86.68 R27.1 R28.1
N$30
  Bottom 0.406: R28.2 D14.K
N$31
  Top 0.406: Q30.G 75.56,84.45 Q29.D
  Bottom 0.406: Q29.D 73.34,86.68 R29.1 R30.1
N$32
  Bottom 0.406: R30.2 D15.K
N$33
  Top 0.406: Q36.G 53.34,57.15 Q35.D
  Bottom 0.406: Q35.D 51.12,59.37 R35.1 R36.1
N$34
  Top 0.406: Q32.G 69.85,84.45 Q31.D
  Bottom 0.406: Q31.D 67.31,86.68 R31.1 R32.1
N$35
  Bottom 0.406: R32.2 D16.K
N$36
  Bottom 0.406: D18.K R36.2
N$37
  Top 0.406: Q38.G 47.62,57.15 Q37.D
  Bottom 0.406: Q37.D 45.4,59.37 R37.1 R38.1
N$38
  Bottom 0.406: R38.2 D19.K
N$39
  Top 0.406: Q40.G 41.91,57.15 Q39.D
  Bottom 0.406: Q39.D 39.69,59.37 R39.1 R40.1
N$40
  Bottom 0.406: R40.2 D20.K
N$41
  Top 0.406: Q42.G 36.2,57.15 Q41.D
  Bottom 0.406: Q41.D 33.97,59.37 R41.1 R42.1
N$42
  Bottom 0.406: R42.2 D21.K
N$43
  Top 0.406: Q44.G 30.48,57.15 Q43.D
  Bottom 0.406: Q43.D 28.26,59.37 R43.1 R44.1
N$44
  Bottom 0.406: R44.2 D22.K
N$45
  Top 0.406: Q46.G 24.77,57.15 Q45.D
  Bottom 0.406: Q45.D 22.54,59.37 R45.1 R46.1
N$46
  Bottom 0.406: D23.K R46.2
N$47
  Top 0.406: Q48.G 19.05,57.15 Q47.D
  Bottom 0.406: Q47.D 16.83,59.37 R47.1 R48.1
N$48
  Bottom 0.406: R48.2 D24.K
N$49
  Top 0.406: Q50.G 59.05,84.45 Q49.D
  Bottom 0.406: Q49.D 56.83,86.68 R49.1 R50.1
N$50
  Bottom 0.406: R50.2 D25.K
N$51
  Top 0.406: Q52.G 53.34,84.45 Q51.D
  Bottom 0.406: Q51.D 51.12,86.68 R51.1 R52.1
N$52
  Bottom 0.406: R52.2 D26.K
N$53
  Top 0.406: Q54.G 47.62,84.45 Q53.D
  Bottom 0.406: Q53.D 45.4,86.68 R53.1 R54.1
N$54
  Bottom 0.406: R54.2 D27.K
N$55
  Top 0.406: Q56.G 41.91,84.45 Q55.D
  Bottom 0.406: Q55.D 39.69,86.68 R55.1 R56.1
N$56
  Bottom 0.406: R56.2 D28.K
N$57
  Top 0.406: Q58.G 36.2,84.45 Q57.D
  Bottom 0.406: Q57.D 33.97,86.68 R57.1 R58.1
N$58
  Bottom 0.406: R58.2 D29.K
N$59
  Top 0.406: Q60.G 30.48,84.45 Q59.D
  Bottom 0.406: Q59.D 28.26,86.68 R59.1 R60.1
N$60
  Bottom 0.406: R60.2 D30.K
N$61
  Top 0.406: Q62.G 24.77,84.45 Q61.D
  Bottom 0.406: Q61.D 22.54,86.68 R61.1 R62.1
N$62
  Bottom 0.406: R62.2 D31.K
N$63
  Top 0.406: Q64.G 19.05,84.45 Q63.D
  Bottom 0.406: Q63.D 16.83,86.68 R63.1 R64.1
N$64
  Bottom 0.406: R64.2 D32.K
N$129
  Bottom 0.406: R134.2 5.71,76.52 D66.K
N$130
  Bottom 0.406: R130.2 5.71,99.69 D65.K
N$133
  Bottom 0.406: R145.1 R146.1 87.31,18.1 Q142.G 92.71,18.1 101.28,26.67 101.28,37.78 105.09,41.59 107.63,41.59 108.58,42.55 Q141.D
N$134
  Bottom 0.406: D69.K R146.2
N$137  (via drill 0.5 pad 1.02)
  Top 0.406: Q143.D v57.78,41.59
  Bottom 0.406: v57.78,41.59 79.69,41.59 81.92,43.5 90.17,43.5 91.76,44.77 101.28,44.77 102.23,45.72 103.5,45.72 104.46,46.67 104.46,48.26 106.68,50.8 Q141.S
N$138  (via drill 0.5 pad 1.02)
  Top 0.406: Q146.D 102.87,32.7 v98.11,27.94
  Bottom 0.406: R147.1 R148.1 79.69,18.1 Q147.G 82.87,19.37 92.71,19.37 98.11,24.77 v98.11,27.94
N$139
  Bottom 0.406: D70.K R148.2
N$142  (via drill 0.5 pad 1.02)
  Top 0.406: Q148.D v52.07,42.23
  Bottom 0.406: v52.07,42.23 52.39,42.55 79.38,42.55 81.28,44.13 89.85,44.13 91.12,45.4 100.33,45.4 101.6,46.67 101.6,49.53 Q146.S
N$143  (via drill 0.5 pad 1.02)
  Top 0.406: Q151.D v97.16,29.84
  Bottom 0.406: R149.1 R150.1 72.07,18.1 Q152.G 74.93,19.05 80.64,19.05 81.6,20 92.08,20 97.16,25.08 v97.16,29.84
N$144
  Bottom 0.406: D71.K R150.2
N$147  (via drill 0.5 pad 1.02)
  Top 0.406: Q153.D v46.35,42.86
  Bottom 0.406: v46.35,42.86 46.67,43.18 79.06,43.18 80.96,44.77 89.53,44.77 90.81,46.04 95.25,46.04 95.89,46.67 95.89,49.53 Q151.S
N$148  (via drill 0.5 pad 1.02)
  Top 0.406: Q156.D 91.44,43.18 93.34,41.27 v93.34,22.86
  Bottom 0.406: R151.1 R152.1 64.45,18.1 Q157.G 68.58,20.32 68.58,21.59 69.85,22.86 v93.34,22.86
N$149
  Bottom 0.406: D72.K R152.2
N$152  (via drill 0.5 pad 1.02)
  Top 0.406: Q158.D v40.64,43.5
  Bottom 0.406: v40.64,43.5 40.96,43.81 78.74,43.81 80.64,45.4 88.9,45.4 90.17,46.67 90.17,49.53 Q156.S
N$153  (via drill 0.5 pad 1.02)
  Top 0.406: Q161.D 85.72,41.91 80.96,37.15 80.96,35.24 79.06,33.34 v79.06,28.26
  Bottom 0.406: R153.1 R154.1 56.83,18.1 Q162.G 61.28,20.64 61.28,21.59 63.18,23.5 77.79,23.5 79.06,24.77 v79.06,28.26
N$154
  Bottom 0.406: D73.K R154.2
N$157  (via drill 0.5 pad 1.02)
  Top 0.406: Q163.D v34.92,44.13
  Bottom 0.406: v34.92,44.13 35.24,44.45 78.42,44.45 80.01,46.04 83.5,46.04 84.45,46.99 84.45,49.53 Q161.S
N$158  (via drill 0.5 pad 1.02)
  Top 0.406: Q166.D 80.01,46.35 75.56,41.91 75.56,39.37 73.34,37.15 73.34,35.24 71.44,33.02 v71.44,28.26
  Bottom 0.406: R155.1 R156.1 49.21,18.1 Q167.G 53.66,20.64 53.66,22.54 55.24,24.13 70.17,24.13 71.44,25.72 v71.44,28.26
N$159
  Bottom 0.406: D74.K R156.2
N$162  (via drill 0.5 pad 1.02)
  Top 0.406: Q168.D v29.21,44.77
  Bottom 0.406: v29.21,44.77 29.53,45.09 77.47,45.09 78.74,46.35 78.74,49.53 Q166.S
N$163  (via drill 0.5 pad 1.02)
  Top 0.406: Q171.D 74.3,46.67 68.26,40.64 68.26,39.69 65.72,37.15 65.72,34.92 63.82,32.7 v63.82,28.26
  Bottom 0.406: R157.1 R158.1 41.59,18.1 Q172.G 46.04,20.64 46.04,23.18 47.62,24.77 62.87,24.77 63.82,25.72 v63.82,28.26
N$164
  Bottom 0.406: D75.K R158.2
N$165
  Bottom 0.406: D85.K R177.2
N$166
  Bottom 0.406: D86.K R178.2
N$171  (via drill 0.5 pad 1.02)
  Top 0.406: Q173.D v23.5,45.4
  Bottom 0.406: v23.5,45.4 23.81,45.72 72.07,45.72 73.03,46.67 73.03,49.53 Q171.S
N$172  (via drill 0.5 pad 1.02)
  Top 0.406: Q176.D 68.58,46.04 64.45,41.91 60.64,41.91 60.01,41.27 60.01,39.05 58.1,37.15 58.1,34.61 56.2,32.7 v56.2,28.26
  Bottom 0.406: R159.1 R160.1 33.97,18.1 Q177.G 38.42,20.64 38.42,24.13 40.01,25.72 55.56,25.72 56.2,26.67 v56.2,28.26
N$173
  Bottom 0.406: D76.K R160.2
N$176
  Bottom 0.406: Q178.D 17.78,46.35 67.31,46.35 67.31,49.53 Q176.S
N$177  (via drill 0.5 pad 1.02)
  Top 0.406: Q181.D 108.58,72.71 107.31,71.44 v107.31,49.53
  Bottom 0.406: R161.1 R162.1 87.31,33.02 Q182.G 90.49,33.02 100.33,42.86 103.82,42.86 107.31,46.35 v107.31,49.53
N$178
  Bottom 0.406: D77.K R162.2
N$181  (via drill 0.5 pad 1.02)
  Top 0.406: Q183.D v57.78,68.9
  Bottom 0.406: v57.78,68.9 58.1,69.22 105.73,69.22 107.31,70.8 107.31,76.83 Q181.S
N$182  (via drill 0.5 pad 1.02)
  Top 0.406: Q186.D 102.87,72.71 101.6,71.44 101.6,46.04 v99.69,43.81
  Bottom 0.406: R163.1 R164.1 79.69,33.02 Q187.G 83.5,34.92 90.81,34.92 v99.69,43.81
N$183
  Bottom 0.406: D78.K R164.2
N$186  (via drill 0.5 pad 1.02)
  Top 0.406: Q188.D v52.07,69.53
  Bottom 0.406: v52.07,69.53 52.39,69.85 100.33,69.85 101.6,71.12 101.6,76.83 Q186.S
N$187  (via drill 0.5 pad 1.02)
  Top 0.406: Q191.D 97.16,72.71 95.89,71.44 95.89,46.67 v93.03,43.81
  Bottom 0.406: R165.1 R166.1 72.07,33.02 Q192.G 75.88,34.92 75.88,36.51 78.74,39.37 88.58,39.37 v93.03,43.81
N$188
  Bottom 0.406: D79.K R166.2
N$191  (via drill 0.5 pad 1.02)
  Top 0.406: Q193.D v46.35,70.17
  Bottom 0.406: v46.35,70.17 46.67,70.48 94.61,70.48 95.89,71.75 95.89,76.83 Q191.S
N$192  (via drill 0.5 pad 1.02)
  Top 0.406: Q196.D 91.44,73.03 90.17,71.75 v90.17,42.55
  Bottom 0.406: v90.17,42.55 86.36,42.55 83.82,40.01 71.44,40.01 68.58,37.15 68.58,35.24 Q197.G 64.45,33.02 R168.1 R167.1
N$193
  Bottom 0.406: D80.K R168.2
N$196  (via drill 0.5 pad 1.02)
  Top 0.406: Q198.D v40.64,70.17
  Bottom 0.406: v40.64,70.17 41.59,71.12 88.58,71.12 90.17,72.71 90.17,76.83 Q196.S
N$197  (via drill 0.5 pad 1.02)
  Top 0.406: Q201.D 85.72,73.03 84.45,71.75 v84.45,42.55
  Bottom 0.406: v84.45,42.55 81.92,42.55 80.01,40.96 64.14,40.96 60.96,37.78 60.96,35.24 Q202.G 56.83,33.02 R170.1 R169.1
N$198
  Bottom 0.406: R170.2 D81.K
N$201  (via drill 0.5 pad 1.02)
  Top 0.406: Q203.D v34.92,71.44
  Bottom 0.406: v34.92,71.44 35.56,71.75 83.19,71.75 84.45,73.03 84.45,76.83 Q201.S
N$202  (via drill 0.5 pad 1.02)
  Top 0.406: Q206.D 80.01,73.03 77.47,70.48 v77.47,68.26 | v56.52,41.59 v56.52,64.45
  Bottom 0.406: R171.1 R172.1 49.21,33.02 Q207.G 53.34,35.24 53.34,38.42 v56.52,41.59 | v56.52,64.45 62.87,64.45 65.41,66.99 76.2,66.99 v77.47,68.26
N$203
  Bottom 0.406: D82.K R172.2
N$206  (via drill 0.5 pad 1.02)
  Top 0.406: Q208.D v29.21,72.07
  Bottom 0.406: v29.21,72.07 29.53,72.39 77.47,72.39 78.11,73.03 78.74,73.98 78.74,76.83 Q206.S
N$207  (via drill 0.5 pad 1.02)
  Top 0.406: Q211.D 74.3,72.71 72.71,71.12 v72.71,68.26 | v50.8,42.23 v50.8,67.63
  Bottom 0.406: R173.1 R174.1 41.59,33.02 Q212.G 45.72,35.24 45.72,37.15 v50.8,42.23 | v50.8,67.63 56.2,67.63 56.52,67.31 63.82,67.31 65.09,68.26 v72.71,68.26
N$208
  Bottom 0.406: D83.K R174.2
N$211  (via drill 0.5 pad 1.02)
  Top 0.406: Q213.D v23.5,72.71
  Bottom 0.406: v23.5,72.71 24.13,72.71 24.45,73.03 72.39,73.03 73.03,73.98 73.03,76.83 Q211.S
N$212  (via drill 0.5 pad 1.02)
  Top 0.406: Q216.D 68.58,72.71 67.31,71.44 63.18,71.44 62.23,70.48 v62.23,68.26 | v39.37,68.58 v39.37,43.18
  Bottom 0.406: v39.37,43.18 38.1,41.91 38.1,35.24 Q217.G 33.97,33.02 R176.1 R175.1 | v62.23,68.26 61.91,67.94 56.83,67.94 56.2,68.58 v39.37,68.58
N$213
  Bottom 0.406: D84.K R176.2
N$216  (via drill 0.5 pad 1.02)
  Top 0.406: Q218.D v17.78,73.66
  Bottom 0.406: v17.78,73.66 67.31,73.66 67.31,76.83 Q216.S
S0_D0
  Bottom 0.406: Q1.G 111.44,60.96 111.44,95.57 110.49,96.52 107.63,96.52 106.36,98.11 106.36,102.55 105.41,103.5 78.42,103.5 77.47,104.46 77.47,107 J1.2
S0_D1  (via drill 0.5 pad 1.02)
  Top 0.406: Q3.G 104.14,74.93 107.31,78.11 v107.31,102.23
  Bottom 0.406: J1.3 78.74,105.41 80.01,104.14 106.68,104.14 107.31,103.5 v107.31,102.23
S0_D2  (via drill 0.5 pad 1.02)
  Top 0.406: Q5.G 98.42,74.93 101.6,78.11 v101.6,96.84 | v80.01,96.52 80.01,107 J1.4
  Bottom 0.406: v101.6,96.84 100.01,98.42 84.45,98.42 82.87,96.52 v80.01,96.52
S0_D3  (via drill 0.5 pad 1.02)
  Top 0.406: Q7.G 92.71,74.93 95.89,78.11 v95.89,96.84 | J1.5 81.28,101.92 82.55,100.65 v82.55,95.57
  Bottom 0.406: v82.55,95.57 83.19,95.57 85.09,97.47 95.25,97.47 v95.89,96.84
S0_D4  (via drill 0.5 pad 1.02)
  Top 0.406: Q9.G 87,74.93 90.17,78.11 90.17,100.65 v88.27,102.55 | J1.6 82.55,107 v82.55,102.55
  Bottom 0.406: v82.55,102.55 82.87,102.87 87.95,102.87 v88.27,102.55
S0_D5
  Top 0.406: Q11.G 81.28,74.93 84.45,78.11 84.45,96.84 83.82,97.47 J1.7
S0_D6  (via drill 0.5 pad 1.02)
  Top 0.406: Q13.G 75.56,74.93 78.74,78.11 v78.74,100.65 | J1.8 85.09,107 v85.09,101.28
  Bottom 0.406: v85.09,101.28 84.14,101.28 83.82,100.97 79.06,100.97 v78.74,100.65
S0_D7  (via drill 0.5 pad 1.02)
  Top 0.406: Q15.G 69.85,74.93 73.03,78.11 v73.03,96.84 | J1.9 v86.36,101.92
  Bottom 0.406: v86.36,101.92 86.04,101.92 85.72,102.23 83.82,102.23 83.19,101.6 76.83,101.6 v73.03,96.84
S0_D8  (via drill 0.5 pad 1.02)
  Top 0.406: J1.12 90.17,107 v90.17,102.55
  Bottom 0.406: v90.17,102.55 90.49,102.55 90.81,102.87 104.46,102.87 105.41,101.92 105.41,96.52 105.73,95.89 108.9,95.89 109.86,94.61 Q17.G
S0_D9  (via drill 0.5 pad 1.02)
  Top 0.406: v91.44,101.92 J1.13
  Bottom 0.406: Q19.G 104.14,95.25 102.55,96.84 102.55,101.6 101.92,102.23 91.76,102.23 v91.44,101.92
S0_D10  (via drill 0.5 pad 1.02)
  Top 0.406: J1.14 92.71,107 v92.71,101.28 | v99.06,101.28 99.06,97.47 98.42,96.84 Q21.G
  Bottom 0.406: v92.71,101.28 93.03,101.28 93.34,101.6 98.74,101.6 v99.06,101.28
S0_D11
  Top 0.406: J1.15 93.98,100.65 92.71,99.38 Q23.G
S0_D12  (via drill 0.5 pad 1.02)
  Top 0.406: v94.3,96.2 94.3,98.74 95.25,99.69 95.25,107 J1.16
  Bottom 0.406: Q25.G 87,94.3 88.27,95.57 93.66,95.57 v94.3,96.2
S0_D13  (via drill 0.5 pad 1.02)
  Top 0.406: Q27.G v81.28,99.69 | v96.52,100.65 J1.17
  Bottom 0.406: v81.28,99.69 81.28,100.01 81.6,100.33 96.2,100.33 v96.52,100.65
S0_D14  (via drill 0.5 pad 1.02)
  Top 0.406: J1.18 97.79,107 v97.79,100.65 | v77.79,99.38 77.79,95.89 75.56,93.66 Q29.G
  Bottom 0.406: v97.79,100.65 97.79,100.01 97.47,99.69 83.19,99.69 82.55,98.74 78.42,98.74 v77.79,99.38
S0_D15  (via drill 0.5 pad 1.02)
  Top 0.406: J1.19 100.65,104.14 v100.65,100.65
  Bottom 0.406: v100.65,100.65 99.06,99.06 83.82,99.06 82.55,97.47 78.74,97.47 75.56,94.61 71.12,94.61 69.85,93.34 Q31.G
S1_D0  (via drill 0.5 pad 1.02)
  Top 0.406: Q33.G 59.37,59.69 60.96,60.96 v60.96,100.65
  Bottom 0.406: J2.2 26.67,107 26.67,104.78 27.94,103.5 53.34,103.5 55.88,100.65 v60.96,100.65
S1_D1  (via drill 0.5 pad 1.02)
  Top 0.406: Q35.G 53.34,75.25 56.52,78.42 v56.52,101.92
  Bottom 0.406: J2.3 27.94,105.41 29.21,104.14 54.29,104.14 v56.52,101.92
S1_D2  (via drill 0.5 pad 1.02)
  Top 0.406: Q37.G 47.62,74.93 50.8,78.11 v50.8,96.52 | J2.4 29.21,107 v29.21,96.84
  Bottom 0.406: v29.21,96.84 30.48,97.79 49.53,97.79 v50.8,96.52
S1_D3  (via drill 0.5 pad 1.02)
  Top 0.406: Q39.G 41.91,74.93 45.09,78.11 v45.09,96.84 | v32.38,96.52 32.38,99.69 30.48,101.6 J2.5
  Bottom 0.406: v45.09,96.84 44.77,97.16 32.38,97.16 v32.38,96.52
S1_D4  (via drill 0.5 pad 1.02)
  Top 0.406: Q41.G 36.2,74.93 39.37,78.11 39.37,100.97 v37.78,102.55 | J2.6 31.75,107 v31.75,102.55
  Bottom 0.406: v31.75,102.55 v37.78,102.55
S1_D5
  Top 0.406: Q43.G 30.48,74.93 33.66,78.11 33.66,99.69 33.02,100.33 J2.7
S1_D6  (via drill 0.5 pad 1.02)
  Top 0.406: Q45.G 24.77,74.93 27.94,78.11 v27.94,100.33 | J2.8 34.29,107 v34.29,100.97
  Bottom 0.406: v34.29,100.97 28.26,100.97 v27.94,100.33
S1_D7  (via drill 0.5 pad 1.02)
  Top 0.406: Q47.G 19.05,74.93 22.23,78.11 v22.23,96.52 | J2.9 v35.56,101.28
  Bottom 0.406: v35.56,101.28 34.92,101.92 32.7,101.92 32.38,101.6 26.67,101.6 24.77,99.38 v22.23,96.52
S1_D8  (via drill 0.5 pad 1.02)
  Top 0.406: Q49.G v59.05,99.69 | v39.37,102.55 39.37,107 J2.12
  Bottom 0.406: v59.05,99.69 55.56,99.69 52.7,102.87 39.69,102.87 v39.37,102.55
S1_D9  (via drill 0.5 pad 1.02)
  Top 0.406: Q51.G v53.34,96.52 | v40.64,101.92 J2.13
  Bottom 0.406: v53.34,96.52 53.34,100.65 51.75,102.23 40.96,102.23 v40.64,101.92
S1_D10  (via drill 0.5 pad 1.02)
  Top 0.406: J2.14 41.91,107 v41.91,101.28 | v48.26,101.28 48.26,99.69 47.62,99.06 Q53.G
  Bottom 0.406: v41.91,101.28 42.23,101.28 42.55,101.6 47.94,101.6 v48.26,101.28
S1_D11
  Top 0.406: J2.15 43.18,100.65 41.91,99.38 Q55.G
S1_D12  (via drill 0.5 pad 1.02)
  Top 0.406: J2.16 44.45,107 44.45,100.01 43.81,99.38 v43.81,96.2 | v36.2,96.2 Q57.G
  Bottom 0.406: v43.81,96.2 v36.2,96.2
S1_D13  (via drill 0.5 pad 1.02)
  Top 0.406: Q59.G v30.48,100.01 | v45.72,100.65 J2.17
  Bottom 0.406: v30.48,100.01 45.09,100.01 v45.72,100.65
S1_D14  (via drill 0.5 pad 1.02)
  Top 0.406: J2.18 46.99,107 v46.99,100.33 | v26.67,99.38 26.67,97.79 24.77,95.89 Q61.G
  Bottom 0.406: v46.99,100.33 46.99,100.01 46.04,99.06 26.99,99.06 v26.67,99.38
S1_D15  (via drill 0.5 pad 1.02)
  Top 0.406: Q63.G v19.05,95.25 | v49.53,100.65 49.53,104.46 J2.19
  Bottom 0.406: v19.05,95.25 25.08,95.25 27.94,98.42 47.62,98.42 v49.53,100.65
SEL0
  Bottom 0.406: Q129.G 3.81,99.38 TP1.P$1
SEL1
  Bottom 0.406: Q132.G 3.81,76.2 TP2.P$1
T0_D0
  Bottom 0.406: Q141.G 109.86,52.07 Q2.D 107.95,52.7 R181.1
T0_D1
  Bottom 0.406: Q146.G 104.14,52.07 Q4.D 102.23,52.7 R182.1
T0_D2
  Bottom 0.406: Q151.G 98.42,52.07 Q6.D 96.52,52.7 R183.1
T0_D3
  Bottom 0.406: Q156.G 92.71,52.07 Q8.D 90.81,52.7 R184.1
T0_D4
  Bottom 0.406: Q161.G 87,52.07 Q10.D 85.09,52.7 R185.1
T0_D5
  Bottom 0.406: Q166.G 81.28,52.07 Q12.D 79.38,52.7 R186.1
T0_D6
  Bottom 0.406: Q171.G 75.56,52.07 Q14.D 73.66,52.7 R187.1
T0_D7
  Bottom 0.406: Q176.G 69.85,52.07 Q16.D 67.94,52.7 R188.1
T0_D8
  Top 0.406: Q181.G 109.86,79.38 Q18.D
  Bottom 0.406: R189.1 107.95,80.01 Q18.D
T0_D9
  Top 0.406: Q186.G 104.14,79.38 Q20.D
  Bottom 0.406: R190.1 102.23,80.01 Q20.D
T0_D10
  Top 0.406: Q191.G 98.42,79.38 Q22.D
  Bottom 0.406: R191.1 96.52,80.01 Q22.D
T0_D11
  Top 0.406: Q196.G 92.71,79.38 Q24.D
  Bottom 0.406: R192.1 90.81,80.01 Q24.D
T0_D12
  Top 0.406: Q201.G 87,79.38 Q26.D
  Bottom 0.406: R193.1 85.09,80.01 Q26.D
T0_D13
  Top 0.406: Q206.G 81.28,79.38 Q28.D
  Bottom 0.406: R194.1 79.38,80.01 Q28.D
T0_D14
  Top 0.406: Q211.G 75.56,79.38 Q30.D
  Bottom 0.406: R195.1 73.66,80.01 Q30.D
T0_D15
  Top 0.406: Q216.G 69.85,79.38 Q32.D
  Bottom 0.406: R196.1 67.94,80.01 Q32.D
T1_D0
  Bottom 0.406: R197.1 57.15,52.7 Q34.D 59.05,52.07 Q143.G
T1_D1
  Bottom 0.406: R198.1 51.44,52.7 Q36.D 53.34,52.07 Q148.G
T1_D2
  Bottom 0.406: R199.1 45.72,52.7 Q38.D 47.62,52.07 Q153.G
T1_D3
  Bottom 0.406: R200.1 40.01,52.7 Q40.D 41.91,52.07 Q158.G
T1_D4
  Bottom 0.406: R201.1 34.29,52.7 Q42.D 36.2,52.07 Q163.G
T1_D5
  Bottom 0.406: R202.1 28.57,52.7 Q44.D 30.48,52.07 Q168.G
T1_D6
  Bottom 0.406: R203.1 22.86,52.7 Q46.D 24.77,52.07 Q173.G
T1_D7
  Bottom 0.406: R204.1 17.14,52.7 Q48.D 19.05,52.07 Q178.G
T1_D8
  Bottom 0.406: Q183.G 59.05,79.38 Q50.D 57.15,80.01 R205.1
T1_D9
  Bottom 0.406: Q188.G 53.34,79.38 Q52.D 51.44,80.01 R206.1
T1_D10
  Bottom 0.406: Q193.G 47.62,79.38 Q54.D 45.72,80.01 R207.1
T1_D11
  Bottom 0.406: Q198.G 41.91,79.38 Q56.D 40.01,80.01 R208.1
T1_D12
  Bottom 0.406: Q203.G 36.2,79.38 Q58.D 34.29,80.01 R209.1
T1_D13
  Bottom 0.406: Q208.G 30.48,79.38 Q60.D 28.57,80.01 R210.1
T1_D14
  Bottom 0.406: Q213.G 24.77,79.38 Q62.D 22.86,80.01 R211.1
T1_D15
  Bottom 0.406: Q218.G 19.05,79.38 Q64.D 17.14,80.01 R212.1

## Text on the board
tPlace: PORT 1 | PORT 0 | D15 | D14 | D13 | D12 | D11 | D10 | D9 | D8 | D15 | D14 | D13 | D12 | D11 | D10 | D9 | D8 | ENABLE 0 | D7 | D6 | D5 | D4 | D3 | D2 | D1 | D0 | D7 | D6 | D5 | D4 | D3 | D2 | D1 | D0 | ENABLE 1 | (1) | JAMES NEWMAN | D15 | D14 | D13 | D12 | D11 | D10 | D9 | D8 | +5V | GND | D7 | D6 | D5 | D4 | D3 | D2 | D1 | D0 | 16 Wide 2:1 Mux | OUTPUT